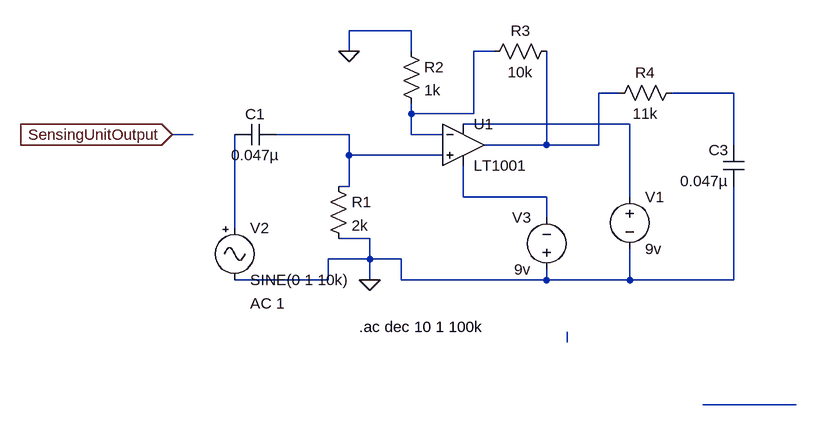
[diagram p0: schematic 6-active Low pass filter ÇALIŞAN DEVRE OUTPUT.asc]
6-active Low pass filter ÇALIŞAN DEVRE OUTPUT.asc, the LTspice schematic file:
Version 4
SHEET 1 1484 680
WIRE 352 -32 256 -32
WIRE 256 0 256 -32
WIRE 352 0 352 -32
WIRE 480 0 448 0
WIRE 672 64 640 64
WIRE 848 64 752 64
WIRE 352 96 352 80
WIRE 448 96 448 0
WIRE 448 96 352 96
WIRE 688 112 432 112
WIRE 16 128 -16 128
WIRE 256 128 144 128
WIRE 352 128 352 96
WIRE 400 128 352 128
WIRE 560 144 560 0
WIRE 560 144 464 144
WIRE 640 144 640 64
WIRE 640 144 560 144
WIRE 848 144 848 64
WIRE 256 160 256 128
WIRE 400 160 256 160
WIRE 256 208 256 160
WIRE 256 208 240 208
WIRE 432 224 432 176
WIRE 560 224 432 224
WIRE 688 224 688 112
WIRE 560 256 560 224
WIRE 80 272 80 128
WIRE 288 288 240 288
WIRE 288 320 288 288
WIRE 288 320 224 320
WIRE 336 320 288 320
WIRE 224 352 224 320
WIRE 224 352 80 352
WIRE 288 352 288 320
WIRE 336 352 336 320
WIRE 560 352 560 336
WIRE 560 352 336 352
WIRE 688 352 688 304
WIRE 688 352 560 352
WIRE 848 352 848 208
WIRE 848 352 688 352
WIRE 592 448 592 432
WIRE 944 544 800 544
FLAG -16 128 SensingUnitOutput
IOPIN -16 128 In
FLAG 288 352 0
FLAG 256 0 0
SYMBOL Opamps\\LT1001 432 80 R0
SYMATTR InstName U1
SYMBOL cap 864 208 R180
WINDOW 0 24 56 Left 2
WINDOW 3 24 8 Left 2
SYMATTR InstName C3
SYMATTR Value 0.047µ
SYMBOL Misc\\signal 80 256 R0
WINDOW 123 24 132 Left 2
WINDOW 39 0 0 Left 0
SYMATTR Value2 AC 1
SYMATTR InstName V2
SYMATTR Value SINE(0 1 10k)
SYMBOL cap 144 112 R90
WINDOW 0 0 32 VBottom 2
WINDOW 3 32 32 VTop 2
SYMATTR InstName C1
SYMATTR Value 0.047µ
SYMBOL res 224 192 R0
SYMATTR InstName R1
SYMATTR Value 2k
SYMBOL res 336 -16 R0
SYMATTR InstName R2
SYMATTR Value 1k
SYMBOL res 576 -16 R90
WINDOW 0 0 56 VBottom 2
WINDOW 3 32 56 VTop 2
SYMATTR InstName R3
SYMATTR Value 10k
SYMBOL voltage 688 208 R0
WINDOW 123 0 0 Left 0
WINDOW 39 0 0 Left 0
SYMATTR InstName V1
SYMATTR Value 9v
SYMBOL voltage 560 352 R180
WINDOW 0 24 96 Left 2
WINDOW 3 24 16 Left 2
SYMATTR InstName V3
SYMATTR Value 9v
SYMBOL res 768 48 R90
WINDOW 0 0 56 VBottom 2
WINDOW 3 32 56 VTop 2
SYMATTR InstName R4
SYMATTR Value 11k
TEXT 272 424 Left 2 !.ac dec 10 1 100k

The netlist it stands for:
* 6-active Low pass filter ÇALIŞAN DEVRE OUTPUT.asc
XU1 N005 N001 N004 N006 N002 LT1001  ; pins In+ In- V+ V- OUT
C3 0 N003 0.047µ
V2 N007 0 SINE(0 1 10k) AC 1
C1 N005 N007 0.047µ
R1 N005 0 2k
R2 0 N001 1k
R3 N002 N001 10k
V1 N004 0 9v
V3 0 N006 9v
R4 N003 N002 11k
.ac dec 10 1 100k
.lib LTC.lib
.backanno
.end